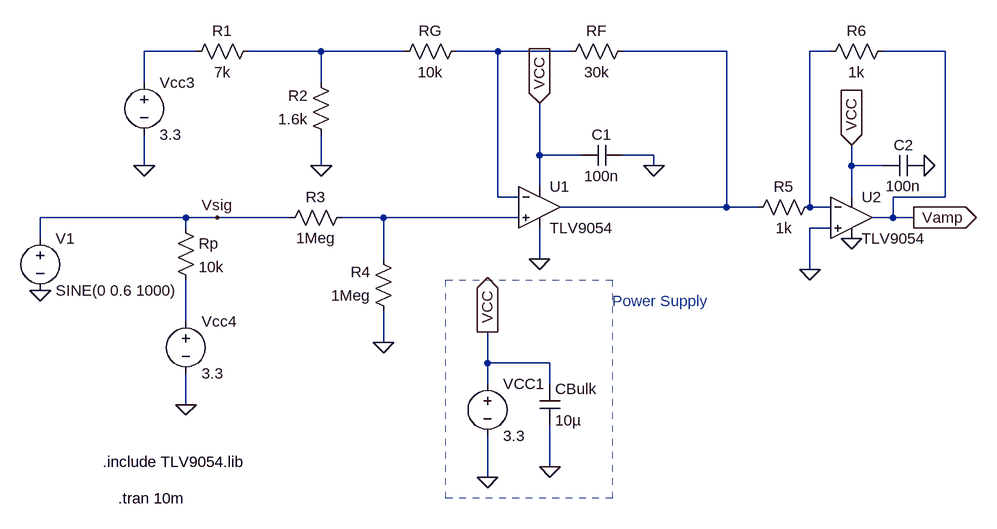
[diagram p0: schematic Project2_1.asc]
Project2_1.asc, the LTspice schematic file:
Version 4.1
SHEET 1 1116 680
WIRE -112 -64 -192 -64
WIRE 80 -64 -32 -64
WIRE 208 -64 80 -64
WIRE 352 -64 288 -64
WIRE 464 -64 352 -64
WIRE 704 -64 544 -64
WIRE 864 -64 832 -64
WIRE 1040 -64 944 -64
WIRE -192 -16 -192 -64
WIRE 80 -16 80 -64
WIRE 416 96 416 16
WIRE 480 96 416 96
WIRE 592 96 544 96
WIRE -192 112 -192 64
WIRE 80 112 80 64
WIRE 592 112 592 96
WIRE 896 112 896 80
WIRE 944 112 896 112
WIRE 416 144 416 96
WIRE 352 160 352 -64
WIRE 384 160 352 160
WIRE 896 160 896 112
WIRE 1040 160 1040 -64
WIRE 1040 160 960 160
WIRE 704 176 704 -64
WIRE 704 176 448 176
WIRE 752 176 704 176
WIRE 832 176 832 -64
WIRE 864 176 832 176
WIRE -128 192 -352 192
WIRE -80 192 -128 192
WIRE 32 192 -80 192
WIRE 176 192 112 192
WIRE 384 192 176 192
WIRE 960 192 960 160
WIRE 960 192 928 192
WIRE 992 192 960 192
WIRE -128 208 -128 192
WIRE 864 208 832 208
WIRE -352 224 -352 192
WIRE 176 256 176 192
WIRE 416 256 416 208
WIRE 832 272 832 208
WIRE -128 352 -128 288
WIRE 176 384 176 336
WIRE 336 416 336 368
WIRE 432 416 336 416
WIRE 336 448 336 416
WIRE 432 448 432 416
WIRE -128 480 -128 432
WIRE 432 576 432 512
WIRE 336 592 336 528
FLAG -192 112 0
FLAG 176 384 0
FLAG 80 112 0
FLAG 592 112 0
FLAG 416 256 0
FLAG 336 592 0
FLAG 432 576 0
FLAG 336 368 VCC
IOPIN 336 368 Out
FLAG 416 16 VCC
IOPIN 416 16 In
FLAG -128 480 0
FLAG -80 192 Vsig
FLAG -352 304 0
FLAG 896 80 VCC
IOPIN 896 80 In
FLAG 896 224 0
FLAG 832 272 0
FLAG 1008 112 0
FLAG 992 192 Vamp
IOPIN 992 192 Out
SYMBOL voltage -192 -32 R0
WINDOW 123 0 0 Left 0
WINDOW 39 0 0 Left 0
SYMATTR InstName Vcc3
SYMATTR Value 3.3
SYMBOL res -16 -80 R90
WINDOW 0 0 56 VBottom 2
WINDOW 3 32 56 VTop 2
SYMATTR InstName R1
SYMATTR Value 7k
SYMBOL res 96 80 R180
WINDOW 0 36 76 Left 2
WINDOW 3 36 40 Left 2
SYMATTR InstName R2
SYMATTR Value 1.6k
SYMBOL res 304 -80 R90
WINDOW 0 0 56 VBottom 2
WINDOW 3 32 56 VTop 2
SYMATTR InstName RG
SYMATTR Value 10k
SYMBOL res 560 -80 R90
WINDOW 0 0 56 VBottom 2
WINDOW 3 32 56 VTop 2
SYMATTR InstName RF
SYMATTR Value 30k
SYMBOL res 128 176 R90
WINDOW 0 0 56 VBottom 2
WINDOW 3 32 56 VTop 2
SYMATTR InstName R3
SYMATTR Value 1Meg
SYMBOL res 192 352 R180
WINDOW 0 36 76 Left 2
WINDOW 3 36 40 Left 2
SYMATTR InstName R4
SYMATTR Value 1Meg
SYMBOL cap 544 80 R90
WINDOW 0 0 32 VBottom 2
WINDOW 3 32 32 VTop 2
SYMATTR InstName C1
SYMATTR Value 100n
SYMBOL voltage 336 432 R0
WINDOW 123 0 0 Left 0
WINDOW 39 0 0 Left 0
SYMATTR InstName VCC1
SYMATTR Value 3.3
SYMBOL cap 416 448 R0
SYMATTR InstName CBulk
SYMATTR Value 10µ
SYMBOL voltage -128 336 R0
WINDOW 123 0 0 Left 0
WINDOW 39 0 0 Left 0
SYMATTR InstName Vcc4
SYMATTR Value 3.3
SYMBOL res -144 192 R0
SYMATTR InstName Rp
SYMATTR Value 10k
SYMBOL TLV9054 416 176 R0
SYMATTR InstName U1
SYMBOL voltage -352 208 R0
WINDOW 123 0 0 Left 0
WINDOW 39 0 0 Left 0
SYMATTR InstName V1
SYMATTR Value SINE(0 0.6 1000)
SYMBOL TLV9054 896 192 R0
SYMATTR InstName U2
SYMBOL res 848 160 R90
WINDOW 0 0 56 VBottom 2
WINDOW 3 32 56 VTop 2
SYMATTR InstName R5
SYMATTR Value 1k
SYMBOL cap 1008 96 R90
WINDOW 0 0 32 VBottom 2
WINDOW 3 32 32 VTop 2
SYMATTR InstName C2
SYMATTR Value 100n
SYMBOL res 960 -80 R90
WINDOW 0 0 56 VBottom 2
WINDOW 3 32 56 VTop 2
SYMATTR InstName R6
SYMATTR Value 1k
TEXT 528 320 Left 2 ;Power Supply
TEXT -256 568 Left 2 !.include TLV9054.lib
TEXT -232 624 Left 2 !.tran 10m
RECTANGLE Normal 528 624 272 288 2

The netlist it stands for:
* Project2_1.asc
Vcc3 N001 0 3.3
R1 N002 N001 7k
R2 0 N002 1.6k
RG N003 N002 10k
RF N004 N003 30k
R3 N006 Vsig 1Meg
R4 0 N006 1Meg
C1 0 VCC 100n
VCC1 VCC 0 3.3
CBulk VCC 0 10µ
Vcc4 N007 0 3.3
Rp Vsig N007 10k
* U1: TLV9054 (symbol TLV9054 not available, pins judged from their places): In+=N006 In-=N003 V+=VCC V-=0 OUT=N004
V1 Vsig 0 SINE(0 0.6 1000)
* U2: TLV9054 (symbol TLV9054 not available, pins judged from their places): In+=0 In-=N005 V+=VCC V-=0 OUT=Vamp
R5 N005 N004 1k
C2 0 VCC 100n
R6 Vamp N005 1k
* Power Supply
.include TLV9054.lib
.tran 10m
.backanno
.end